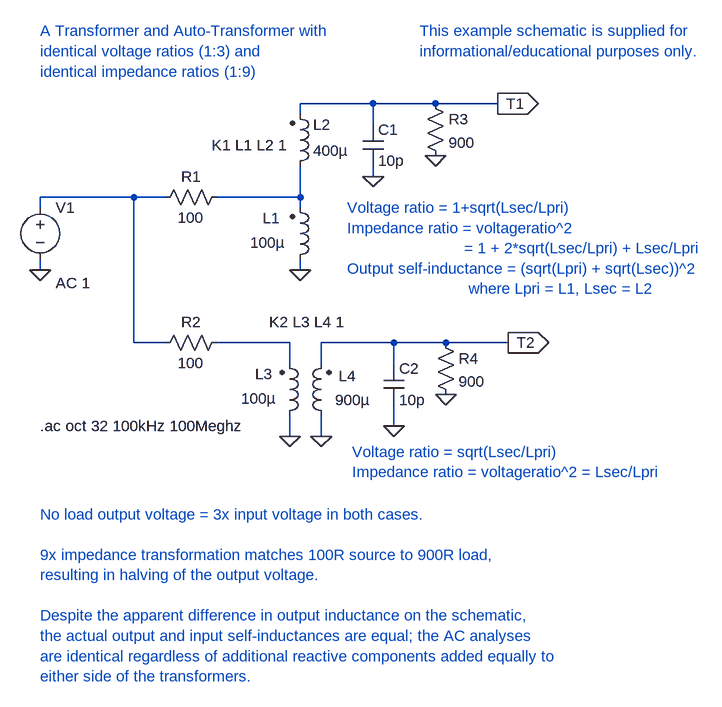
[diagram p0: schematic AutoTransformer.asc]
AutoTransformer.asc, the LTspice schematic file:
Version 4
SHEET 1 880 904
WIRE 224 32 112 32
WIRE 320 32 224 32
WIRE 416 32 320 32
WIRE 112 48 112 32
WIRE 224 64 224 32
WIRE 224 144 224 128
WIRE -144 176 -288 176
WIRE -96 176 -144 176
WIRE 112 176 112 128
WIRE 112 176 -16 176
WIRE -288 192 -288 176
WIRE 112 192 112 176
WIRE -288 288 -288 272
WIRE 112 288 112 272
WIRE -144 400 -144 176
WIRE -96 400 -144 400
WIRE 96 400 -16 400
WIRE 256 400 144 400
WIRE 336 400 256 400
WIRE 432 400 336 400
WIRE 96 432 96 400
WIRE 144 432 144 400
WIRE 256 432 256 400
WIRE 256 528 256 496
WIRE 96 544 96 512
WIRE 144 544 144 512
FLAG -288 288 0
FLAG 112 288 0
FLAG 96 544 0
FLAG 144 544 0
FLAG 416 32 T1
IOPIN 416 32 Out
FLAG 432 400 T2
IOPIN 432 400 Out
FLAG 320 112 0
FLAG 336 480 0
FLAG 224 144 0
FLAG 256 528 0
SYMBOL ind2 96 288 M180
WINDOW 0 -15 80 Right 0
WINDOW 3 -7 42 Right 0
SYMATTR InstName L1
SYMATTR Value 100µ
SYMATTR Type ind
SYMBOL ind2 96 144 M180
WINDOW 0 36 80 Left 0
WINDOW 3 36 40 Left 0
SYMATTR InstName L2
SYMATTR Value 400µ
SYMATTR Type ind
SYMBOL voltage -288 176 R0
WINDOW 123 24 132 Left 0
WINDOW 39 0 0 Left 0
SYMATTR InstName V1
SYMATTR Value ""
SYMATTR Value2 AC 1
SYMBOL ind2 160 528 R180
WINDOW 0 -38 77 Left 0
WINDOW 3 -60 40 Left 0
SYMATTR InstName L4
SYMATTR Value 900µ
SYMBOL ind2 80 528 M180
WINDOW 0 -37 80 Left 0
WINDOW 3 -59 42 Left 0
SYMATTR InstName L3
SYMATTR Value 100µ
SYMBOL res 0 160 R90
WINDOW 0 0 56 VBottom 0
WINDOW 3 32 56 VTop 0
SYMATTR InstName R1
SYMATTR Value 100
SYMBOL res 0 384 R90
WINDOW 0 0 56 VBottom 0
WINDOW 3 32 56 VTop 0
SYMATTR InstName R2
SYMATTR Value 100
SYMBOL res 304 16 R0
SYMATTR InstName R3
SYMATTR Value 900
SYMBOL res 320 384 R0
SYMATTR InstName R4
SYMATTR Value 900
SYMBOL cap 208 64 R0
SYMATTR InstName C1
SYMATTR Value 10p
SYMBOL cap 240 432 R0
SYMATTR InstName C2
SYMATTR Value 10p
TEXT -24 96 Left 0 !K1 L1 L2 1
TEXT -288 528 Left 0 !.ac oct 32 100kHz 100Meghz
TEXT -288 -80 Left 0 ;A Transformer and Auto-Transformer with \nidentical voltage ratios (1:3) and \nidentical impedance ratios (1:9)
TEXT 64 368 Left 0 !K2 L3 L4 1
TEXT 184 192 Left 0 ;Voltage ratio = 1+sqrt(Lsec/Lpri)\nImpedance ratio = voltageratio^2\n                          = 1 + 2*sqrt(Lsec/Lpri) + Lsec/Lpri\nOutput self-inductance = (sqrt(Lpri) + sqrt(Lsec))^2\n                           where Lpri = L1, Lsec = L2
TEXT 192 568 Left 0 ;Voltage ratio = sqrt(Lsec/Lpri)\nImpedance ratio = voltageratio^2 = Lsec/Lpri
TEXT -288 664 Left 0 ;No load output voltage = 3x input voltage in both cases.\n \n9x impedance transformation matches 100R source to 900R load,\nresulting in halving of the output voltage.\n \nDespite the apparent difference in output inductance on the schematic, \nthe actual output and input self-inductances are equal; the AC analyses\nare identical regardless of additional reactive components added equally to\neither side of the transformers.
TEXT 296 -80 Left 0 ;This example schematic is supplied for \ninformational/educational purposes only.

The netlist it stands for:
* AutoTransformer.asc
L1 0 N002 100µ
L2 N002 T1 400µ
V1 N001 0 AC 1
L4 0 T2 900µ
L3 0 N003 100µ
R1 N002 N001 100
R2 N003 N001 100
R3 T1 0 900
R4 T2 0 900
C1 T1 0 10p
C2 T2 0 10p
K1 L1 L2 1
.ac oct 32 100kHz 100Meghz
* A Transformer and Auto-Transformer with
* identical voltage ratios (1:3) and
* identical impedance ratios (1:9)
K2 L3 L4 1
* Voltage ratio = 1+sqrt(Lsec/Lpri)
* Impedance ratio = voltageratio^2
*                           = 1 + 2*sqrt(Lsec/Lpri) + Lsec/Lpri
* Output self-inductance = (sqrt(Lpri) + sqrt(Lsec))^2
*                            where Lpri = L1, Lsec = L2
* Voltage ratio = sqrt(Lsec/Lpri)
* Impedance ratio = voltageratio^2 = Lsec/Lpri
* No load output voltage = 3x input voltage in both cases.
* 9x impedance transformation matches 100R source to 900R load,
* resulting in halving of the output voltage.
* Despite the apparent difference in output inductance on the schematic,
* the actual output and input self-inductances are equal; the AC analyses
* are identical regardless of additional reactive components added equally to
* either side of the transformers.
* This example schematic is supplied for
* informational/educational purposes only.
.backanno
.end